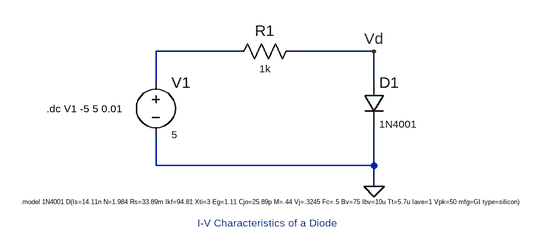
[diagram p0: schematic IV_Characteristics_Diode.asc]
IV_Characteristics_Diode.asc, the LTspice schematic file:
Version 4
SHEET 1 1340 680
WIRE 352 256 224 256
WIRE 560 256 432 256
WIRE 224 304 224 256
WIRE 560 304 560 256
WIRE 224 432 224 384
WIRE 560 432 560 368
WIRE 560 432 224 432
WIRE 560 464 560 432
FLAG 560 464 0
FLAG 560 256 Vd
SYMBOL Res 336 272 R270
WINDOW 0 32 56 VTop 2
WINDOW 3 0 56 VBottom 1
SYMATTR InstName R1
SYMATTR Value 1k
SYMBOL Diode 544 304 R0
WINDOW 3 24 64 Left 1
SYMATTR Value 1N4001
SYMATTR InstName D1
SYMBOL Voltage 224 288 R0
WINDOW 3 24 96 Left 1
SYMATTR Value 5
SYMATTR InstName V1
TEXT 16 488 Left 0 !.model 1N4001 D(Is=14.11n N=1.984 Rs=33.89m Ikf=94.81 Xti=3 Eg=1.11 Cjo=25.89p M=.44 Vj=.3245 Fc=.5 Bv=75 Ibv=10u Tt=5.7u Iave=1 Vpk=50 mfg=GI type=silicon)
TEXT 56 344 Left 1 !.dc V1 -5 5 0.01
TEXT 288 520 Left 1 ;I-V Characteristics of a Diode

The netlist it stands for:
* IV_Characteristics_Diode.asc
R1 N001 Vd 1k
D1 Vd 0 1N4001
V1 N001 0 5
.model D D
.lib standard.dio
.model 1N4001 D(Is=14.11n N=1.984 Rs=33.89m Ikf=94.81 Xti=3 Eg=1.11 Cjo=25.89p M=.44 Vj=.3245 Fc=.5 Bv=75 Ibv=10u Tt=5.7u Iave=1 Vpk=50 mfg=GI type=silicon)
.dc V1 -5 5 0.01
* I-V Characteristics of a Diode
.backanno
.end